# Altium schematic sheet POWER.SchDoc
size A4
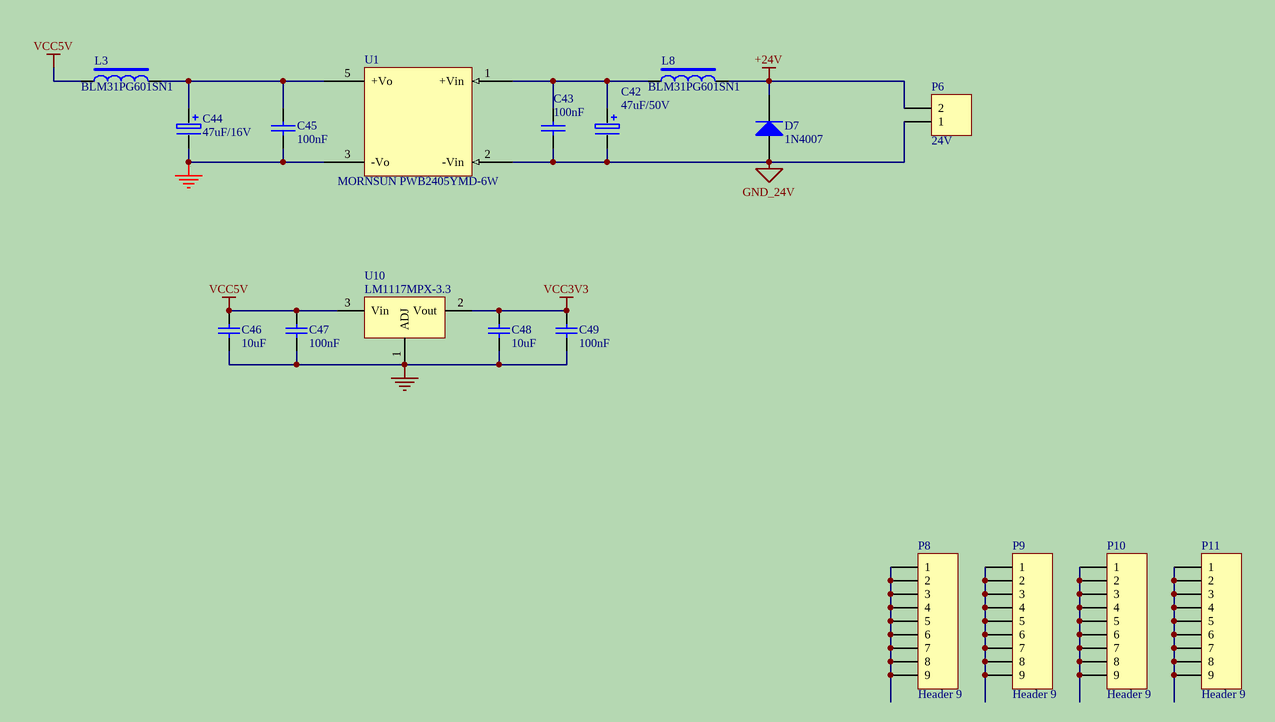
[diagram p0: POWER.SchDoc]

## Parts
C42  47uF/50V  [CD1/2]
C43  100nF  [C0805]
C44  47uF/16V  [CD1/2]
C45  100nF  [C0805]
C46  10uF  [C1206]
C47  100nF  [C0805]
C48  10uF  [C1206]
C49  100nF  [C0805]
D7  1N4007  [DO-41]
L3  BLM31PG601SN1  [L1206]
L8  BLM31PG601SN1  [L1206]
P6  24V  [3.96-2]
P8  Header 9  [lk]
P9  Header 9  [lk]
P10  Header 9  [lk]
P11  Header 9  [lk]
U1  MORNSUN PWB2405YMD-6W  [DC/DC-1X1]
U10  LM1117MPX-3.3  [SOT-223]

## Nets
+24V: D7.2(K) L8.2 P6.2
GND: C44.2 C45.2 C46.1 C47.1 C48.1 C49.1 U1.3(-Vo) U10.1(ADJ)
GND_24V: C42.2 C43.2 D7.1(A) P6.1 U1.2(-Vin)
NC: U1.4(NC)
VCC3V3: C48.2 C49.2 U10.2(Vout)
VCC5V: C46.2 C47.2 L3.1 U10.3(Vin)
NetC42_1: C42.1 C43.1 L8.1 U1.1(+Vin)
NetC44_1: C44.1 C45.1 L3.2 U1.5(+Vo)
NetP8_1: P8.1 P8.2 P8.3 P8.4 P8.5 P8.6 P8.7 P8.8 P8.9
NetP9_1: P9.1 P9.2 P9.3 P9.4 P9.5 P9.6 P9.7 P9.8 P9.9
NetP10_1: P10.1 P10.2 P10.3 P10.4 P10.5 P10.6 P10.7 P10.8 P10.9
NetP11_1: P11.1 P11.2 P11.3 P11.4 P11.5 P11.6 P11.7 P11.8 P11.9

## Library data of the parts
C42 C44 = CD1: Electrolytic Capacitor; Text Field1: 4.7uF:4V-A;6.3V-A;10V-A;16V-BA;20V-BA;25V-CB;35V-DC;50V-D;; Text Field2: 10uF:4V-AB;6.3V-BA;10V-BA;16V-CBA;20V-CB;25V-DC;35V-D;; Text Field3: 22uF:4V-BA;6.3V-CBA;10V-CB;16V-DBC;20V-DC;25V-D;35V-D;; Text Field4: 33uF:4V-CAB;6.3V-CBA;10V-DBC;16V-DCB;20V-DC;25V-DE;; Text Field5: 47uF:4V-CBA;6.3V-DBC;10V-DBC;16V-DC;20V-DE;; Text Field6: 68uF:4V-DBC;6.3V-DCB;10V-DCB;16V-D;20V-DE;; Text Field7: 100uF:4V-DCB;6.3V-EDBC;10V-DC;16V-DE;20V-E;; Text Field8: 220uF:4V-EDC;6.3V-ED;10V-ED;
C43 C45 = CC: Capacitor
C46-C49 = CAP: Capacitor; Value: 100pF; Published: 8-Jun-2000; Revision: July-2002: Re-released for DXP Platform.; Publisher: Altium Limited
D7 = Diode 1N4007: 1 Amp General Purpose Rectifier; Published: 8-Jun-2000; LatestRevisionDate: 17-Jul-2002; LatestRevisionNote: Re-released for DXP Platform.; DatasheetVersion: 1998; PackageVersion: Aug-1999; PackageReference: DO-41; Publisher: Altium Limited; PackageDescription: Diode, Axial; Body 5.2 x 2.7 mm (LxDia. max), Lead Dia. 0.86 mm (max); Code_JEDEC: DO-204-AL; ComponentLink1Description: Manufacturer Link; ComponentLink1URL: http://www.fairchildsemi.com/; ComponentLink2Description: Datasheet; ComponentLink2URL: http://www.fairchildsemi.com/ds/1N%2F1N4001.pdf
L3 L8 = INDUCTOR2
P6 = Header 2: Header, 2-Pin; LatestRevisionDate: 17-Jul-2002; LatestRevisionNote: Re-released for DXP Platform.; Publisher: Altium Limited
P8-P11 = Header 9: Header, 9-Pin; LatestRevisionDate: 17-Jul-2002; LatestRevisionNote: Re-released for DXP Platform.; Publisher: Altium Limited
U1 = 48S5: Text Field1: 80; Text Field2: 80
U10 = LM1117: 3-Terminal Adjustable Positive Voltage Regulator